# EAGLE design FAL65816_6567a (EAGLE 7.2.0)
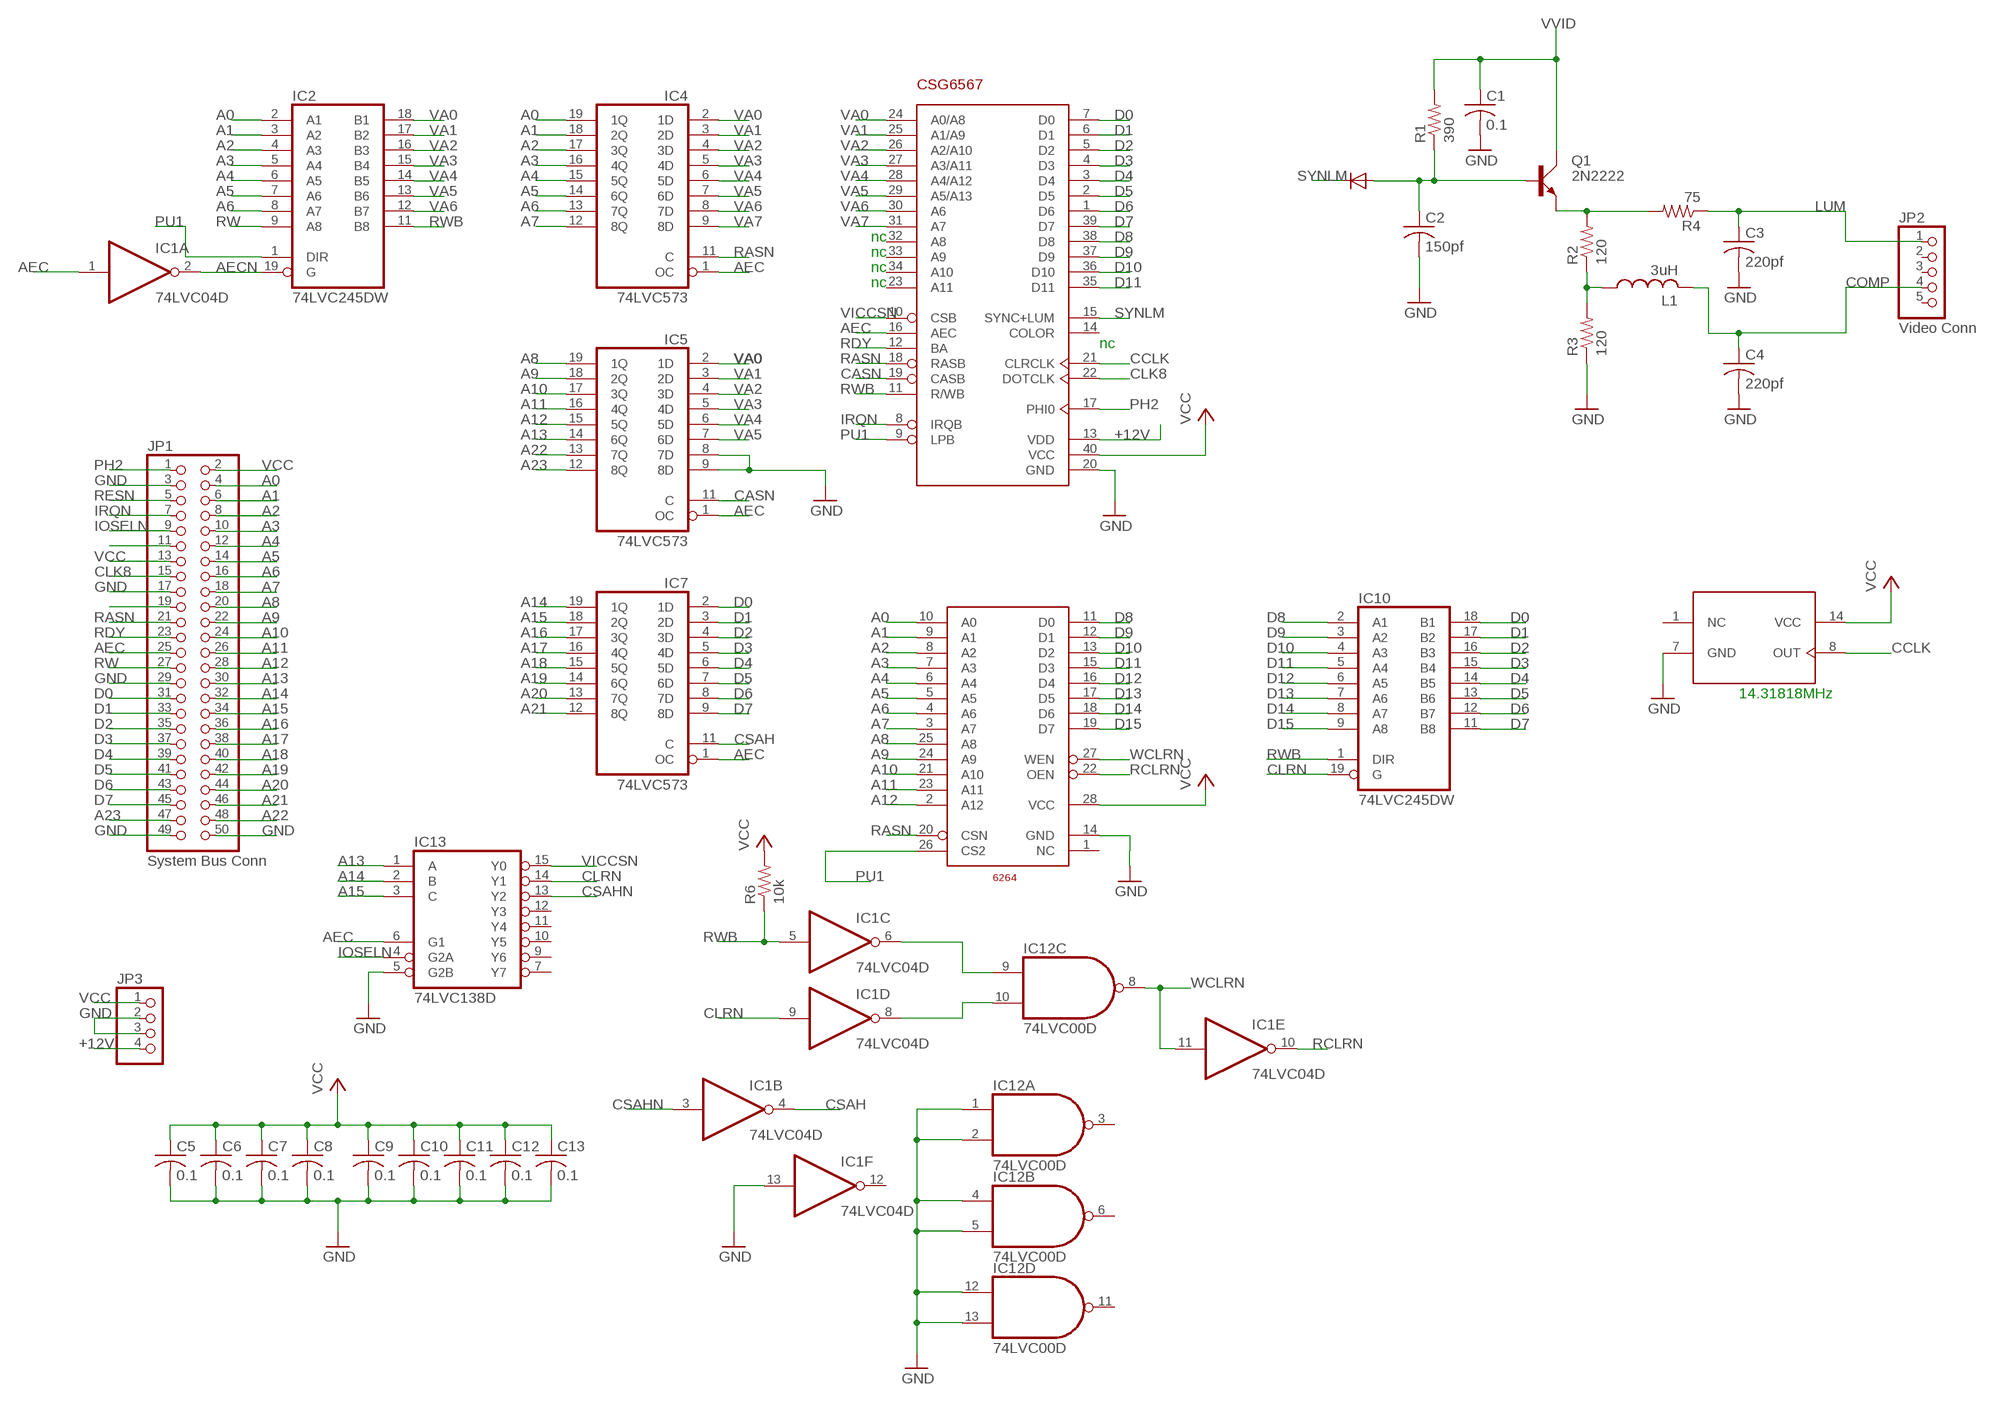
[diagram p0: schematic, sheet 1]

## Parts
C1  0.1  C-US050-024X044  [C050-024X044]
C2  150pf  C-US050-024X044  [C050-024X044]
C3  220pf  C-US050-024X044  [C050-024X044]
C4  220pf  C-US050-024X044  [C050-024X044]
C5  0.1  C-US050-024X044  [C050-024X044]
C6  0.1  C-US050-024X044  [C050-024X044]
C7  0.1  C-US050-024X044  [C050-024X044]
C8  0.1  C-US050-024X044  [C050-024X044]
C9  0.1  C-US050-024X044  [C050-024X044]
C10  0.1  C-US050-024X044  [C050-024X044]
C11  0.1  C-US050-024X044  [C050-024X044]
C12  0.1  C-US050-024X044  [C050-024X044]
C13  0.1  C-US050-024X044  [C050-024X044]
IC1  74LVC04D  74LS04D  [SO14]
IC2  74LVC245DW  74LS245DW  [SO20W]
IC4  74LVC573  [SO20W]
IC5  74LVC573  [SO20W]
IC7  74LVC573  [SO20W]
IC10  74LVC245DW  74LS245DW  [SO20W]
IC12  74LVC00D  74LS00D  [SO14]
IC13  74LVC138D  74LS138D  [SO16]
JP1  System Bus Conn  PINHD-2X25/90  [2X25/90]
JP2  Video Conn  PINHD-1X5  [1X05]
JP3  PINHD-1X4/90  [1X04/90]
L1  3uH  L-US0204/7  [0204/7]
Q1  2N2222  [TO18A]
R1  390  R-US_0204/7  [0204/7]
R2  120  R-US_0204/7  [0204/7]
R3  120  R-US_0204/7  [0204/7]
R4  75  R-US_0204/7  [0204/7]
R6  10k  R-US_0204/7  [0204/7]
U$1  CSG6567  [DIP-40]
U$3  OSC14  [DIL14]
U$4  6264  [DIL28-6]

## Nets
+12V: JP3.4 U$1.13(VDD)
A0: IC2.2(A1) IC4.19(1Q) JP1.4 U$4.10(A0)
A1: IC2.3(A2) IC4.18(2Q) JP1.6 U$4.9(A1)
A2: IC2.4(A3) IC4.17(3Q) JP1.8 U$4.8(A2)
A3: IC2.5(A4) IC4.16(4Q) JP1.10 U$4.7(A3)
A4: IC2.6(A5) IC4.15(5Q) JP1.12 U$4.6(A4)
A5: IC2.7(A6) IC4.14(6Q) JP1.14 U$4.5(A5)
A6: IC2.8(A7) IC4.13(7Q) JP1.16 U$4.4(A6)
A7: IC4.12(8Q) JP1.18 U$4.3(A7)
A8: IC5.19(1Q) JP1.20 U$4.25(A8)
A9: IC5.18(2Q) JP1.22 U$4.24(A9)
A10: IC5.17(3Q) JP1.24 U$4.21(A10)
A11: IC5.16(4Q) JP1.26 U$4.23(A11)
A12: IC5.15(5Q) JP1.28 U$4.2(A12)
A13: IC5.14(6Q) IC13.1(A) JP1.30
A14: IC7.19(1Q) IC13.2(B) JP1.32
A15: IC7.18(2Q) IC13.3(C) JP1.34
A16: IC7.17(3Q) JP1.36
A17: IC7.16(4Q) JP1.38
A18: IC7.15(5Q) JP1.40
A19: IC7.14(6Q) JP1.42
A20: IC7.13(7Q) JP1.44
A21: IC7.12(8Q) JP1.46
A22: IC5.13(7Q) JP1.48
A23: IC5.12(8Q) JP1.47
AEC: IC1.1(A:I) IC4.1(OC) IC5.1(OC) IC7.1(OC) IC13.6(G1) JP1.25 U$1.16(AEC)
AECN: IC1.2(A:O) IC2.19(G)
CASN: IC5.11(C) U$1.19(CASB)
CCLK: U$1.21(CLRCLK) U$3.8(OUT)
CLK8: JP1.15 U$1.22(DOTCLK)
CLRN: IC1.9(D:I) IC10.19(G) IC13.14(Y1)
COMP: C4.1 JP2.4 L1.2
CSAH: IC1.4(B:O) IC7.11(C)
CSAHN: IC1.3(B:I) IC13.13(Y2)
D0: IC7.2(1D) IC10.18(B1) JP1.31 U$1.7(D0)
D1: IC7.3(2D) IC10.17(B2) JP1.33 U$1.6(D1)
D2: IC7.4(3D) IC10.16(B3) JP1.35 U$1.5(D2)
D3: IC7.5(4D) IC10.15(B4) JP1.37 U$1.4(D3)
D4: IC7.6(5D) IC10.14(B5) JP1.39 U$1.3(D4)
D5: IC7.7(6D) IC10.13(B6) JP1.41 U$1.2(D5)
D6: IC7.8(7D) IC10.12(B7) JP1.43 U$1.1(D6)
D7: IC7.9(8D) IC10.11(B8) JP1.45 U$1.39(D7)
D8: IC10.2(A1) U$1.38(D8) U$4.11(D0)
D9: IC10.3(A2) U$1.37(D9) U$4.12(D1)
D10: IC10.4(A3) U$1.36(D10) U$4.13(D2)
D11: IC10.5(A4) U$1.35(D11) U$4.15(D3)
D12: IC10.6(A5) U$4.16(D4)
D13: IC10.7(A6) U$4.17(D5)
D14: IC10.8(A7) U$4.18(D6)
D15: IC10.9(A8) U$4.19(D7)
GND: C1.2 C2.2 C3.2 C4.2 C5.2 C6.2 C7.2 C8.2 C9.2 C10.2 C11.2 C12.2 C13.2 IC1.13(F:I) IC5.8(7D) IC5.9(8D) IC12.1(A:I0) IC12.2(A:I1) IC12.4(B:I0) IC12.5(B:I1) IC12.12(D:I0) IC12.13(D:I1) IC13.5(G2B) JP1.3 JP1.17 JP1.29 JP1.49 JP1.50 JP3.2 JP3.3 R3.1 U$1.20(GND) U$3.7(GND) U$4.14(GND)
IOSELN: IC13.4(G2A) JP1.9
IRQN: JP1.7 U$1.8(IRQB)
LUM: C3.1 JP2.1 R4.1
N$5: IC1.6(C:O) IC12.9(C:I0)
N$6: IC1.8(D:O) IC12.10(C:I1)
N$10: JP1.19
N$15: C2.1 Q1.B R1.1
N$17: L1.1 R2.1 R3.2
N$18: Q1.E R2.2 R4.2
N$40: JP1.11
PH2: JP1.1 U$1.17(PHI0)
PU1: IC2.1(DIR) U$1.9(LPB) U$4.26(CS2)
RASN: IC4.11(C) JP1.21 U$1.18(RASB) U$4.20(CSN)
RCLRN: IC1.10(E:O) U$4.22(OEN)
RDY: JP1.23 U$1.12(BA)
RESN: JP1.5
RW: IC2.9(A8) JP1.27
RWB: IC1.5(C:I) IC2.11(B8) IC10.1(DIR) R6.1 U$1.11(R/WB)
SYNLM: U$1.15(SYNC+LUM)
VA0: IC2.18(B1) IC4.2(1D) IC5.2(1D) U$1.24(A0/A8)
VA1: IC2.17(B2) IC4.3(2D) IC5.3(2D) U$1.25(A1/A9)
VA2: IC2.16(B3) IC4.4(3D) IC5.4(3D) U$1.26(A2/A10)
VA3: IC2.15(B4) IC4.5(4D) IC5.5(4D) U$1.27(A3/A11)
VA4: IC2.14(B5) IC4.6(5D) IC5.6(5D) U$1.28(A4/A12)
VA5: IC2.13(B6) IC4.7(6D) IC5.7(6D) U$1.29(A5/A13)
VA6: IC2.12(B7) IC4.8(7D) U$1.30(A6)
VA7: IC4.9(8D) U$1.31(A7)
VCC: C5.1 C6.1 C7.1 C8.1 C9.1 C10.1 C11.1 C12.1 C13.1 JP1.2 JP1.13 JP3.1 R6.2 U$1.40(VCC) U$3.14(VCC) U$4.28(VCC)
VICCSN: IC13.15(Y0) U$1.10(CSB)
VVID: C1.1 Q1.C R1.2
WCLRN: IC1.11(E:I) IC12.8(C:O) U$4.27(WEN)
Unconnected: IC1.12(F:O) IC12.3(A:O) IC12.6(B:O) IC12.11(D:O) IC13.7(Y7) IC13.9(Y6) IC13.10(Y5) IC13.11(Y4) IC13.12(Y3) JP2.2 JP2.3 JP2.5 U$1.14(COLOR) U$1.23(A11) U$1.32(A8) U$1.33(A9) U$1.34(A10) U$3.1(NC) U$4.1(NC)

## Notes on the sheet
- nc
- nc
- nc
- nc
- nc
- 14.31818MHz

## Power pins joined to a net without a drawn wire
GND: IC1.7(P:GND) IC2.10(GND) IC4.10(GND) IC5.10(GND) IC7.10(GND) IC10.10(GND) IC12.7(P:GND) IC13.8(GND)
VCC: IC1.14(P:VCC) IC2.20(VCC) IC4.20(VCC) IC5.20(VCC) IC7.20(VCC) IC10.20(VCC) IC12.14(P:VCC) IC13.16(VCC)

## Library data of the parts
C1 C3 C4 = resistor:C-US: CAPACITOR, American symbol
C2 C5-C13 = rcl:C-US: CAPACITOR, American symbol
IC1 = 74xx-us:74*04: Hex INVERTER
IC2 = FT74xx:74*245: Octal BUS TRANSCEIVER, 3-state
IC4 IC5 IC7 = FT74xx:74*573: 8-bit D latch BUS DRIVER
IC10 = 74xx-us:74*245: Octal BUS TRANSCEIVER, 3-state
IC12 = 74xx-us:74*00: Quad 2-input NAND gate
IC13 = FT74xx:74*138: 3-line to 8-line DECODER/DEMULTIPLEXER
JP1 = pinhead:PINHD-2X25: PIN HEADER
JP2 = pinhead:PINHD-1X5: PIN HEADER
JP3 = pinhead:PINHD-1X4: PIN HEADER
L1 = resistor:L-US: INDUCTOR, American symbol
Q1 = transistor-small-signal:2N2222: NPN TRANSISTOR
R1-R4 R6 = resistor:R-US_: RESISTOR, American symbol
U$1 = 65xxx:CSG6567
U$3 = FT74xx:OSC14
U$4 = FT74xx:6264: 8kx8 Static RAM

## Board
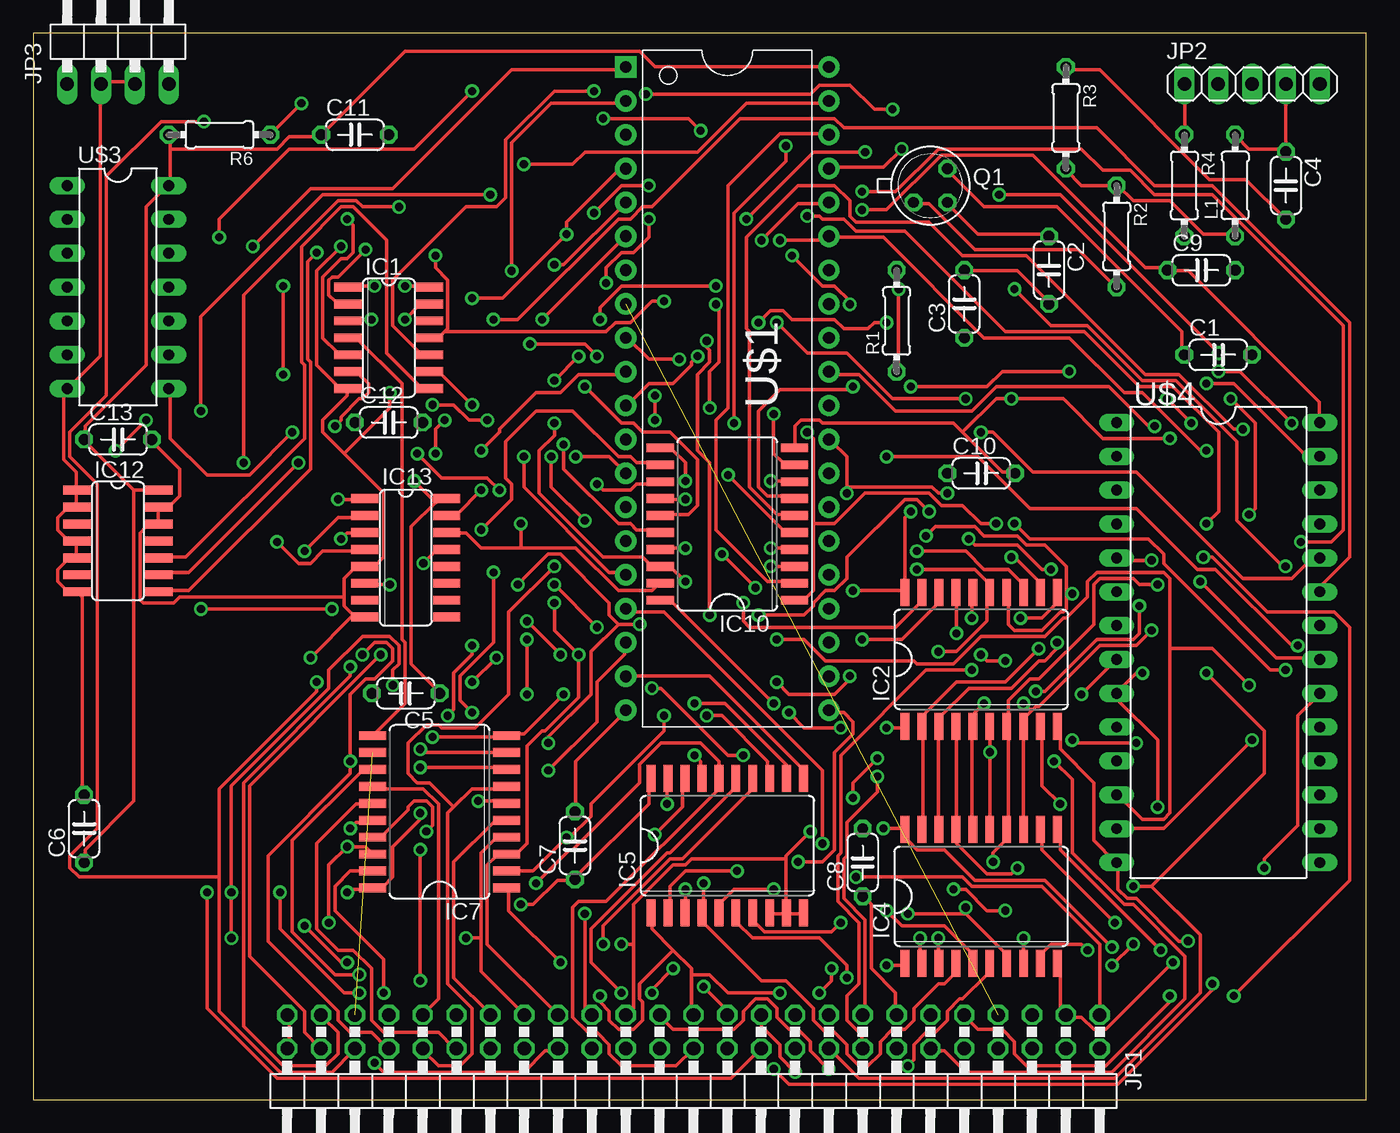
[diagram p1: board, top side]
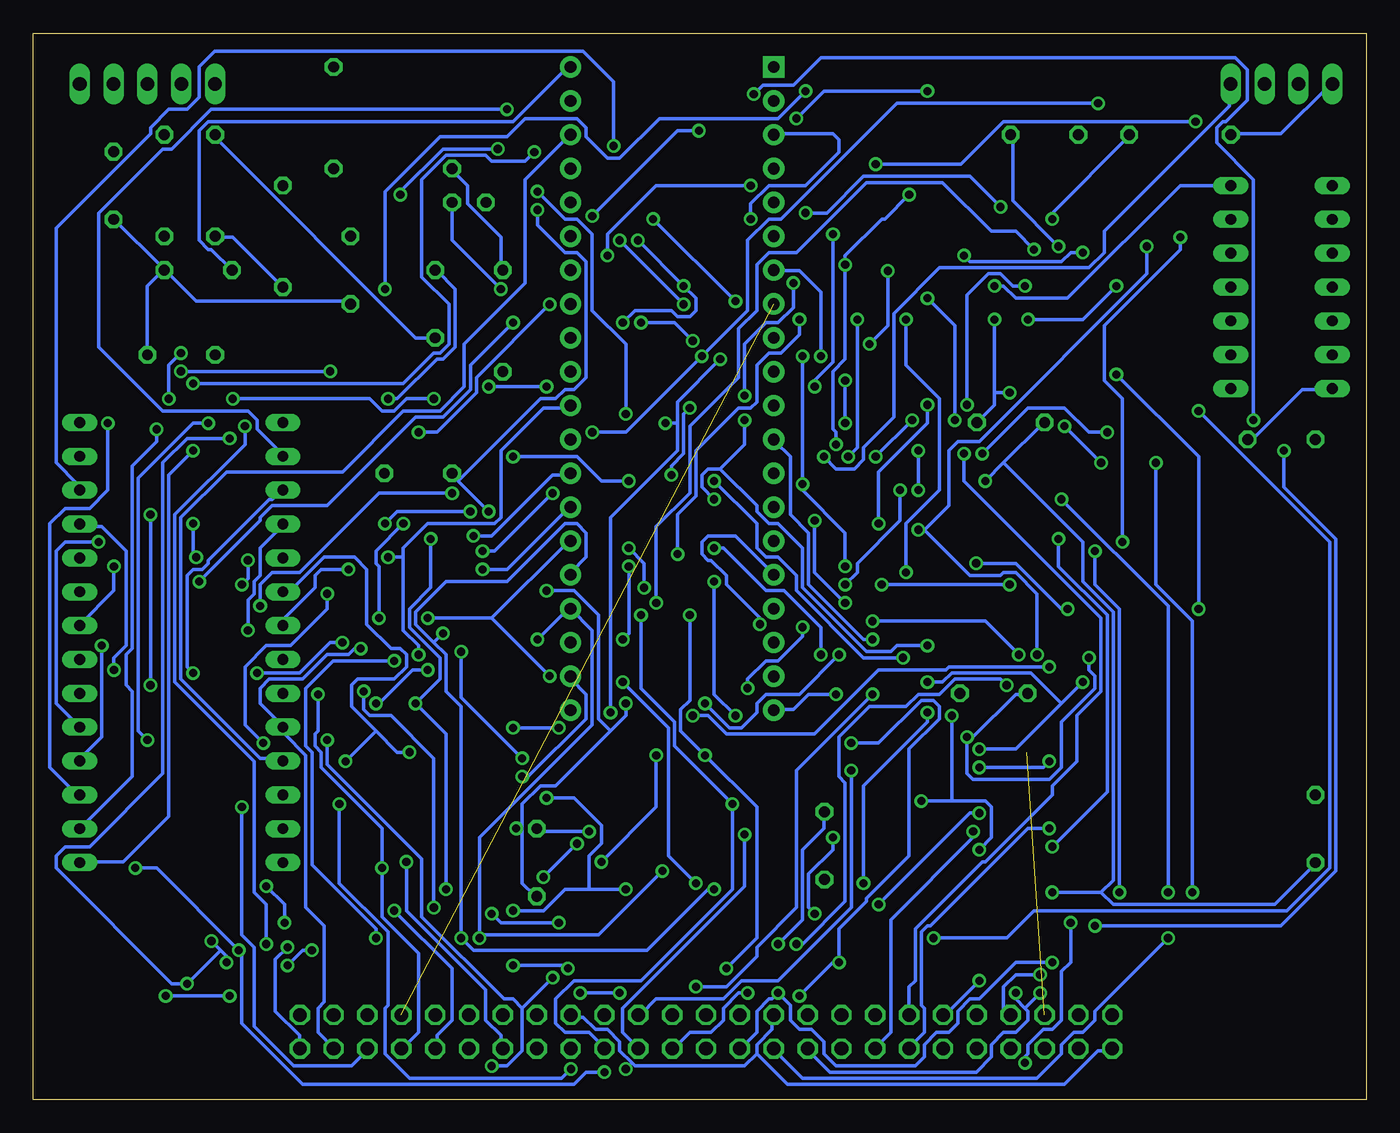
[diagram p2: board, bottom side, seen from below]

Size 100 x 80 mm. Coordinates in mm from the lower left corner, seen from the top.
Outline: 0,0 100,0 100,80 0,80 0,0
Copper layers (1*16): Top 0.035mm / dielectric 1.5mm / Bottom 0.035mm
Design rules "default": minimum track width 10mil, minimum drill 24mil, track to track 8mil, track to pad 8mil, pad to pad 8mil, via to via 8mil, smd to smd 8mil, copper to edge 40mil, drill to drill 8mil, minimum pad ring 10mil, minimum via ring 8mil, stop-mask expansion 4mil, vias tented up to drill 0mil, thermal gap 10mil

### Footprints (pad centres in the part's own frame; a part is rotated, then mirrored left to right if it is on the bottom)
C050-024X044 = drill 0.813 octagon: 1 -2.54,0; 2 2.54,0
SO14 = smd 0.66 x 2.032: 1 -3.81,-3.073; 2 -2.54,-3.073; 3 -1.27,-3.073; 4 0,-3.073; 5 1.27,-3.073; 6 2.54,-3.073; 7 3.81,-3.073; 8 3.81,3.073; 9 2.54,3.073; 10 1.27,3.073; 11 0,3.073; 12 -1.27,3.073; 13 -2.54,3.073; 14 -3.81,3.073
SO20W = smd 0.66 x 2.032: 1 -5.715,-5.029; 2 -4.445,-5.029; 3 -3.175,-5.029; 4 -1.905,-5.029; 5 -0.635,-5.029; 6 0.635,-5.029; 7 1.905,-5.029; 8 3.175,-5.029; 9 4.445,-5.029; 10 5.715,-5.029; 11 5.715,5.029; 12 4.445,5.029; 13 3.175,5.029; 14 1.905,5.029; 15 0.635,5.029; 16 -0.635,5.029; 17 -1.905,5.029; 18 -3.175,5.029; 19 -4.445,5.029; 20 -5.715,5.029
SO16 = smd 0.66 x 2.032: 1 -4.445,-3.073; 2 -3.175,-3.073; 3 -1.905,-3.073; 4 -0.635,-3.073; 5 0.635,-3.073; 6 1.905,-3.073; 7 3.175,-3.073; 8 4.445,-3.073; 9 4.445,3.073; 10 3.175,3.073; 11 1.905,3.073; 12 0.635,3.073; 13 -0.635,3.073; 14 -1.905,3.073; 15 -3.175,3.073; 16 -4.445,3.073
2X25/90 = drill 1.016 octagon: 1 -29.21,-6.35; 2 -29.21,-3.81; 3 -26.67,-6.35; 4 -26.67,-3.81; 5 -24.13,-6.35; 6 -24.13,-3.81; 7 -21.59,-6.35; 8 -21.59,-3.81; 9 -19.05,-6.35; 10 -19.05,-3.81; 11 -16.51,-6.35; 12 -16.51,-3.81; 13 -13.97,-6.35; 14 -13.97,-3.81; 15 -11.43,-6.35; 16 -11.43,-3.81; 17 -8.89,-6.35; 18 -8.89,-3.81; 19 -6.35,-6.35; 20 -6.35,-3.81; 21 -3.81,-6.35; 22 -3.81,-3.81; 23 -1.27,-6.35; 24 -1.27,-3.81; 25 1.27,-6.35; 26 1.27,-3.81; 27 3.81,-6.35; 28 3.81,-3.81; 29 6.35,-6.35; 30 6.35,-3.81; 31 8.89,-6.35; 32 8.89,-3.81; 33 11.43,-6.35; 34 11.43,-3.81; 35 13.97,-6.35; 36 13.97,-3.81; 37 16.51,-6.35; 38 16.51,-3.81; 39 19.05,-6.35; 40 19.05,-3.81; 41 21.59,-3.81; 42 21.59,-6.35; 43 24.13,-3.81; 44 24.13,-6.35; 45 26.67,-3.81; 46 26.67,-6.35; 47 29.21,-3.81; 48 29.21,-6.35; 49 31.75,-3.81; 50 31.75,-6.35
1X05 = drill 1.016 long: 1 -5.08,0; 2 -2.54,0; 3 0,0; 4 2.54,0; 5 5.08,0
1X04/90 = drill 1.016 long: 1 -3.81,-3.81; 2 -1.27,-3.81; 3 1.27,-3.81; 4 3.81,-3.81
0204/7 = drill 0.813 octagon: 1 -3.81,0; 2 3.81,0
TO18A = drill 0.813 octagon: B 1.27,-1.27; C 1.27,1.27; E -1.27,-1.27
DIP-40 = drill 0.889 pad 1.6 square: 1 -22.86,-7.62 | drill 0.889 pad 1.6: 2 -20.32,-7.62; 3 -17.78,-7.62; 4 -15.24,-7.62; 5 -12.7,-7.62; 6 -10.16,-7.62; 7 -7.62,-7.62; 8 -5.08,-7.62; 9 -2.54,-7.62; 10 0,-7.62; 11 2.54,-7.62; 12 5.08,-7.62; 13 7.62,-7.62; 14 10.16,-7.62; 15 12.7,-7.62; 16 15.24,-7.62; 17 17.78,-7.62; 18 20.32,-7.62; 19 22.86,-7.62; 20 25.4,-7.62; 21 25.4,7.62; 22 22.86,7.62; 23 20.32,7.62; 24 17.78,7.62; 25 15.24,7.62; 26 12.7,7.62; 27 10.16,7.62; 28 7.62,7.62; 29 5.08,7.62; 30 2.54,7.62; 31 0,7.62; 32 -2.54,7.62; 33 -5.08,7.62; 34 -7.62,7.62; 35 -10.16,7.62; 36 -12.7,7.62; 37 -15.24,7.62; 38 -17.78,7.62; 39 -20.32,7.62; 40 -22.86,7.62
DIL14 = drill 0.813 long: 1 -7.62,-3.81; 2 -5.08,-3.81; 3 -2.54,-3.81; 4 0,-3.81; 5 2.54,-3.81; 6 5.08,-3.81; 7 7.62,-3.81; 8 7.62,3.81; 9 5.08,3.81; 10 2.54,3.81; 11 0,3.81; 12 -2.54,3.81; 13 -5.08,3.81; 14 -7.62,3.81
DIL28-6 = drill 0.813 long: 1 -16.51,-7.62; 2 -13.97,-7.62; 3 -11.43,-7.62; 4 -8.89,-7.62; 5 -6.35,-7.62; 6 -3.81,-7.62; 7 -1.27,-7.62; 8 1.27,-7.62; 9 3.81,-7.62; 10 6.35,-7.62; 11 8.89,-7.62; 12 11.43,-7.62; 13 13.97,-7.62; 14 16.51,-7.62; 15 16.51,7.62; 16 13.97,7.62; 17 11.43,7.62; 18 8.89,7.62; 19 6.35,7.62; 20 3.81,7.62; 21 1.27,7.62; 22 -1.27,7.62; 23 -3.81,7.62; 24 -6.35,7.62; 25 -8.89,7.62; 26 -11.43,7.62; 27 -13.97,7.62; 28 -16.51,7.62

### Placement (x,y rotation side)
C1  88.9,55.88 0 top
C2  76.2,62.23 270 top
C3  69.85,59.69 90 top
C4  93.98,68.58 270 top
C5  27.94,30.48 180 top
C6  3.81,20.32 90 top
C7  40.64,19.05 90 top
C8  62.23,17.78 90 top
C9  87.63,62.23 0 top
C10  71.12,46.99 0 top
C11  24.13,72.39 0 top
C12  26.67,50.8 0 top
C13  6.35,49.53 0 top
IC1  26.67,57.15 270 top
IC2  71.12,33.02 0 top
IC4  71.12,15.24 0 top
IC5  52.07,19.05 0 top
IC7  30.48,21.59 90 top
IC10  52.07,43.18 90 top
IC12  6.35,41.91 270 top
IC13  27.94,40.64 270 top
JP1  50.8,0 180 top
JP2  91.44,76.2 0 top
JP3  6.35,80.01 0 top
L1  90.17,68.58 90 top
Q1  67.31,68.58 0 top
R1  64.77,58.42 90 top
R2  81.28,64.77 270 top
R3  77.47,73.66 270 top
R4  86.36,68.58 270 top
R6  13.97,72.39 180 top
U$1  52.07,54.61 270 top
U$3  6.35,60.96 270 top
U$4  88.9,34.29 270 top

### Tracks (layer width: path | path; a pad name or v marks a point on that pad's centre or on a via)
+12V  (via drill 0.61)
  Top 0.254: v40.69,48.23 43.2,48.23 U$1.13
  Bottom 0.254: v40.69,48.23 39.78,47.32 38.41,47.32 37.72,48.01 37.72,48.92 35.43,51.21 35.43,58.98 32,62.41 20.8,62.41 19.66,63.55 19.66,65.15 10.29,74.52 10.29,76.12 JP3.4
A0  (via drill 0.61)
  Top 0.254: IC4.19 66.75,20.34 66.75,27.89 IC2.2 66.75,28.12 66.75,28.8 69.27,31.32 72.92,31.32 v75.44,33.83
  Bottom 0.254: JP1.4 77.5,3.89 78.64,5.03 78.64,6.86 78.18,7.32 78.18,13.03 79.55,14.4 79.55,25.83 81.15,27.43 81.15,27.89 U$4.10 81.38,28.12 82.98,29.72 82.98,30.86 82.3,31.55 79.78,31.55 77.95,33.38 76.35,33.38 75.89,33.83 v75.44,33.83
A1  (via drill 0.61)
  Top 0.254: IC4.18 67.89,20.34 67.89,27.89 IC2.3 68.12,28.12 68.12,28.8 70.18,30.86 73.38,30.86 75.44,32.92 75.89,32.92 76.81,33.83 v76.81,34.29 | v84.35,21.95 84.35,26.98 81.38,29.95 81.38,30.4 U$4.9 81.38,30.63 82.75,32 v83.21,32
  Bottom 0.254: v84.35,21.95 84.35,12.34 83.44,11.43 83.44,5.49 80.47,2.52 76.12,2.52 74.98,3.66 JP1.6 | v76.81,34.29 77.72,34.29 80.01,32 v83.21,32
A2  (via drill 0.61)
  Top 0.254: IC2.4 69.27,27.89 69.27,20.34 IC4.17 69.27,20.12 69.27,19.2 71.55,16.92 73.38,16.92 v73.84,17.37 | v78.64,30.4 81.15,32.92 U$4.8
  Bottom 0.254: v78.64,30.4 78.64,27.66 78.87,27.43 78.87,26.52 78.41,26.06 78.41,24.92 73.84,20.34 v73.84,17.37 73.84,13.72 71.09,10.97 71.09,5.03 72.24,3.89 JP1.8
A3  (via drill 0.61)
  Top 0.254: IC4.16 70.41,20.34 70.41,27.89 IC2.5 70.64,28.12 70.64,29.03 v71.32,29.72 | v76.35,39.78 75.67,39.78 73.84,41.6 70.64,41.6 v70.18,42.06 | v72.92,14.17 71.55,14.17 69.95,15.77 v69.04,15.77
  Bottom 0.254: v76.35,39.78 78.41,39.78 78.87,39.32 78.87,38.41 81.15,36.12 81.15,35.66 U$4.7 | v70.18,42.06 70.18,38.41 71.78,36.8 71.78,35.43 69.49,33.15 69.49,31.55 v71.32,29.72 69.04,27.43 v69.04,15.77 | v72.92,14.17 68.58,9.83 68.58,5.94 69.72,4.8 69.72,3.89 JP1.10
A4  (via drill 0.61)
  Top 0.254: IC4.15 71.78,20.34 v71.78,26.06 71.78,27.89 IC2.6 | v76.58,25.38 77.95,24 77.95,18.52 81.84,14.63 82.53,14.63 86.41,10.74 86.41,7.54 80.92,2.06 69.95,2.06 68.35,3.66 67.44,3.66 JP1.12
  Bottom 0.254: 74.3,27.66 72.69,26.06 v71.78,26.06 | 74.3,27.66 76.12,29.49 76.12,31.09 75.67,31.55 72.92,31.55 72.01,32.46 72.01,33.38 72.47,33.83 73.15,33.83 74.98,35.66 74.98,39.78 75.89,40.69 78.18,40.69 80.7,38.18 81.15,38.18 U$4.6 | 74.3,27.66 v76.58,25.38
A5  (via drill 0.61)
  Top 0.254: v83.9,40.46 81.38,40.46 U$4.5 | v84.35,38.63 82.98,38.63 82.53,39.09 80.01,39.09 79.55,38.63 79.55,35.66 75.44,31.55 74.75,31.55 73.15,29.95 73.15,28.12 IC2.7 73.15,27.89 73.15,20.34 IC4.14 72.92,20.12 72.92,19.43 72.01,18.52 v72.01,17.83
  Bottom 0.254: v83.9,40.46 83.9,39.09 v84.35,38.63 | v72.01,17.83 72.01,14.17 66.06,8.23 66.06,5.94 64.92,4.8 64.92,3.89 JP1.14
A6  (via drill 0.61)
  Top 0.254: IC4.13 IC2.8 74.3,28.57 74.98,29.26 | v83.9,35.2 82.75,34.06 80.01,34.06 75.44,29.49 75.21,29.49 74.98,29.26 | v70.41,32.23 66.98,32.23 60.58,25.83 60.58,18.52 60.35,18.29 60.35,14.86 61.95,13.26 61.95,8.69 61.04,7.77 61.04,5.94 62.18,4.8 62.18,3.89 JP1.16 | v74.3,29.72 74.75,29.26 74.98,29.26
  Bottom 0.254: v83.9,35.2 83.9,37.49 83.44,37.95 83.44,38.86 82.98,39.32 82.98,41.38 81.38,42.98 U$4.4 | v70.41,32.23 71.55,32.23 74.07,29.72 v74.3,29.72
A7  (via drill 0.61)
  Top 0.254: v81.15,13.26 75.67,18.75 75.67,20.12 IC4.12 | 83.9,16 v82.53,16 | 83.9,16 87.55,12.34 87.55,8 81.15,1.6 61.95,1.6 59.89,3.66 JP1.18 | v88.01,32 92.35,27.66 92.35,24.46 83.9,16
  Bottom 0.254: v81.15,13.26 81.15,14.63 v82.53,16 | v88.01,32 88.47,32.46 88.47,39.32 88.01,39.78 87.33,39.78 86.87,40.23 86.87,40.46 82.3,45.03 82.07,45.03 81.38,45.72 U$4.3
A8  (via drill 0.61)
  Top 0.254: v47.55,22.17 47.55,24 IC5.19 | v93.95,32.23 92.81,32.23 84.81,40.23 84.81,40.92 83.67,42.06 74.75,42.06 v73.61,43.2 | v67.21,44.12 66.29,45.03 65.38,45.03 61.04,40.69 61.04,39.09 60.12,38.18 59.44,38.18 58.52,37.26 58.52,37.03 57.84,36.35 v54.41,36.35
  Bottom 0.254: JP1.20 57.15,3.89 58.29,5.03 60.12,5.03 60.81,5.71 60.81,7.54 59.44,8.91 54.41,8.91 47.55,15.77 v47.55,22.17 51.89,26.52 51.89,28.35 54.41,30.86 v54.41,36.35 | v93.95,32.23 93.95,33.15 93.04,34.06 93.04,41.15 94.87,42.98 96.47,42.98 U$4.25 | v73.61,43.2 72.69,44.12 v67.21,44.12
A9  (via drill 0.61)
  Top 0.254: v46.63,19.89 48.69,21.95 48.69,24 IC5.18 | v71.09,50.06 72.01,50.06 74.98,47.09 82.75,47.09 90.75,39.09 94.41,39.09 95.78,40.46 96.47,40.46 U$4.24 | v61.27,59.66 61.27,59.89 60.12,61.04 59.21,61.04 v56.92,63.32 | v46.18,68.58 44.12,68.58 v42.06,66.52 | v27.43,66.98 24.69,66.98 24.23,67.44 22.86,67.44 15.77,60.35 v15.77,47.78 | v13.03,15.54 13.03,6.86 18.29,1.6 52.35,1.6 54.41,3.66 JP1.22
  Bottom 0.254: v46.63,19.89 46.63,16 55.78,6.86 55.78,5.03 54.63,3.89 JP1.22 | v71.09,50.06 69.72,50.06 66.75,53.03 66.75,54.18 v61.27,59.66 | v56.92,63.32 56.92,64.92 53.26,68.58 v46.18,68.58 | v42.06,66.52 40.46,66.52 37.72,69.27 29.72,69.27 v27.43,66.98 | v15.77,47.78 15.77,38.63 13.03,35.89 v13.03,15.54
A10  (via drill 0.61)
  Top 0.254: v49.61,25.83 50.06,25.38 50.06,24.23 IC5.17 | v48.01,9.83 46.41,8.23 v46.41,8 | v87.55,38.86 93.27,33.15 96.47,33.15 U$4.21 | v64.01,58.29 63.09,58.29 62.64,57.84 60.81,57.84 60.12,58.52 56.92,58.52 56.24,59.21 55.32,59.21 v54.41,58.29 | v50.52,56.92 50.52,56.46 50.75,56.24 50.75,55.32 49.84,54.41 49.84,48.69 50.75,47.78 v50.75,36.35
  Bottom 0.254: v48.01,9.83 45.72,12.12 45.72,21.95 v49.61,25.83 51.44,27.66 51.44,29.26 50.75,29.95 v50.75,36.35 | v46.41,8 47.09,8 48.23,6.86 48.23,5.94 49.15,5.03 50.75,5.03 51.89,3.89 JP1.24 | v87.55,38.86 82.98,43.43 82.98,43.66 82.07,44.58 77.95,44.58 71.32,51.21 69.27,51.21 67.21,53.26 67.21,55.09 v64.01,58.29 | v54.41,58.29 51.89,58.29 v50.52,56.92
A11  (via drill 0.61)
  Top 0.254: JP1.26 48.23,2.52 44.12,2.52 43.2,3.43 43.2,4.12 42.29,5.03 41.6,5.03 40.46,6.17 40.46,14.4 40.92,14.86 42.98,14.86 51.44,23.32 IC5.16 51.44,25.38 50.06,26.75 47.09,26.75 45.49,25.15 45.49,23.77 40.46,18.75 40.23,18.75 v37.72,16.23 | v34.52,58.52 36.35,58.52 43.89,66.06 44.81,66.06 45.72,66.98 46.41,66.98 53.03,73.61 60.12,73.61 60.81,72.92 79.78,72.92 84.12,68.58 88.47,68.58 98.75,58.29 98.75,40.69 96.7,38.63 96.7,38.18 U$4.23 | v34.52,39.55 34.52,34.29 32,31.77 32,29.95 v32.92,29.03
  Bottom 0.254: v34.52,58.52 34.52,55.09 32,52.58 32,45.72 34.52,43.2 v34.52,39.55 | v32.92,29.03 32.92,28.35 37.72,23.55 v37.72,16.23
A12  (via drill 0.61)
  Top 0.254: v44.12,8 41.83,10.29 41.83,12.8 47.55,18.52 47.78,18.52 52.58,23.32 52.58,24 IC5.15 | v64.47,74.3 63.09,74.3 61.27,76.12 58.98,76.12 58.29,75.44 v45.95,75.44 | v6.17,48.69 v8.46,50.98 | v20.34,13.03 23.09,10.29 v23.55,10.29
  Bottom 0.254: JP1.28 46.86,3.89 45.72,5.03 45.72,6.63 44.81,7.54 44.58,7.54 v44.12,8 43.2,7.09 43.2,5.94 42.52,5.26 41.6,5.26 40.69,4.34 40.69,3.43 39.78,2.52 33.83,2.52 33.15,3.2 33.15,4.12 32.23,5.03 31.32,5.03 30.63,5.71 30.63,6.63 29.72,7.54 29.03,7.54 26.29,10.29 v23.55,10.29 | v64.47,74.3 86.64,74.3 89.61,71.32 90.3,71.32 95.1,66.52 95.1,56.46 90.3,51.66 83.9,51.66 83.21,50.98 83.21,50.29 81.38,48.46 U$4.2 | v45.95,75.44 45.26,76.12 42.98,76.12 40.92,78.18 9.83,78.18 8.91,77.27 8.91,74.98 10.52,73.38 10.74,73.38 11.2,72.92 11.2,71.78 8.46,69.04 v8.46,50.98 | v6.17,48.69 6.17,45.95 2.29,42.06 2.29,17.14 6.4,13.03 v20.34,13.03
A13  (via drill 0.61)
  Top 0.254: v22.86,45.03 24.69,45.03 IC13.1 | v14.86,12.12 v14.86,15.54 14.86,23.55 22.17,30.86 22.17,32.23 24.69,34.75 26.75,34.75 27.43,34.06 27.43,32.69 26.98,32.23 v26.98,31.09 | v42.75,11.66 42.75,13.03 47.78,18.06 48.69,18.06 53.95,23.32 53.95,24 IC5.14
  Bottom 0.254: v22.86,45.03 14.86,37.03 v14.86,15.54 | v14.86,12.12 20.34,6.63 20.34,5.94 21.26,5.03 21.95,5.03 22.86,4.12 22.86,3.43 24.69,1.6 42.29,1.6 44.35,3.66 JP1.30 | v42.75,11.66 42.29,11.66 39.09,14.86 39.09,23.77 39.55,24.23 39.55,27.2 37.26,29.49 34.52,29.49 33.6,30.4 32,30.4 30.86,31.55 27.43,31.55 v26.98,31.09
A14  (via drill 0.61)
  Top 0.254: IC7.19 23.77,17.14 22.63,16 22.63,14.17 26.29,10.52 v26.29,8 | v20.34,41.15 22.86,43.66 24.69,43.66 IC13.2 | v18.52,15.54 18.52,12.8 23.32,8 v24.46,8
  Bottom 0.254: v26.29,8 26.29,7.54 25.6,6.86 | 25.6,6.86 25.38,6.63 25.38,5.94 26.29,5.03 27.2,5.03 28.12,4.12 28.12,3.2 29.26,2.06 40.23,2.06 41.83,3.66 JP1.32 | v20.34,41.15 20.34,38.63 18.52,36.8 v18.52,15.54 | 25.6,6.86 v24.46,8
A15  (via drill 0.61)
  Top 0.254: v23.09,42.06 23.55,42.52 24.69,42.52 IC13.3 | IC7.18 25.38,18.52 24.92,18.97 v23.55,18.97 22.17,17.6 v22.17,13.26 | v25.6,2.74 26.29,2.06 36.8,2.06 38.41,3.66 39.32,3.66 JP1.34
  Bottom 0.254: v23.09,42.06 23.09,40.01 19.43,36.35 19.43,23.09 v23.55,18.97 | v25.6,2.74 25.6,3.2 25.38,3.43 25.38,4.12 24.23,5.26 23.55,5.26 22.86,5.94 22.86,9.6 22.17,10.29 v22.17,13.26
A16  (via drill 0.61)
  Top 0.254: v29.49,20.12 29.95,20.57 29.95,21.95 29.49,22.4 28.57,22.4 28.12,21.95 28.12,21.72 26.29,19.89 25.6,19.89 IC7.17
  Bottom 0.254: v29.49,20.12 29.49,19.66 35.66,13.49 35.66,5.03 36.8,3.89 JP1.36
A17  (via drill 0.61)
  Top 0.254: v23.77,20.34 24.23,20.8 25.38,20.8 IC7.16
  Bottom 0.254: v23.77,20.34 25.38,20.34 32.69,13.03 32.92,13.03 33.38,12.57 33.38,7.09 33.15,6.86 33.15,5.03 34.29,3.89 JP1.38
A18
  Top 0.254: IC7.15 25.38,22.17 24.23,22.17 21.26,19.2 21.26,12.8 22.86,11.2 24,11.2 25.38,9.83 25.38,5.94 26.29,5.03 30.4,5.03 31.55,3.89 JP1.40
A19
  Top 0.254: JP1.42 30.4,7.54 30.4,22.17 29.26,23.32 25.6,23.32 IC7.14
A20  (via drill 0.61)
  Top 0.254: v24.46,9.37 22.63,9.37 19.43,12.57 19.43,19.43 24.69,24.69 25.38,24.69 IC7.13
  Bottom 0.254: v24.46,9.37 26.29,9.37 27.2,8.46 27.2,6.86 26.75,6.4 JP1.44
A21  (1 unrouted)
A22  (via drill 0.61)
  Top 0.254: v50.52,28.8 51.66,28.8 55.09,25.38 55.09,24.23 IC5.13 | v23.77,32.46 23.77,31.77 15.77,23.77 15.77,5.49 18.75,2.52 21.95,2.52 22.86,3.43 22.86,5.03 21.72,6.17 JP1.48
  Bottom 0.254: v50.52,28.8 49.38,28.8 48.01,27.43 41.38,27.43 36.58,32.23 31.55,32.23 31.32,32.46 v23.77,32.46
A23  (via drill 0.61)
  Top 0.254: v49.61,29.72 51.89,29.72 56.46,25.15 56.46,24.23 IC5.12 | v37.03,35.89 v39.55,33.38 | v26.06,33.38 16.23,23.55 16.23,10.74 20.34,6.63 20.34,5.03 21.49,3.89 JP1.47
  Bottom 0.254: v49.61,29.72 47.78,27.89 46.86,27.89 45.72,29.03 45.72,29.72 45.03,30.4 42.52,30.4 v39.55,33.38 | v37.03,35.89 28.57,35.89 v26.06,33.38
AEC  (via drill 0.61)
  Top 0.254: 48.01,11.2 49.38,9.83 49.38,9.37 | 48.01,11.2 46.41,12.8 46.41,13.95 IC5.1 | 49.38,9.37 49.38,6.4 JP1.25 | v39.55,10.29 35.66,14.17 35.66,15.77 IC7.1 | v42.52,7.77 42.52,7.32 43.2,6.63 43.2,5.94 43.89,5.26 45.03,5.26 45.72,5.94 45.72,7.32 45.49,7.54 45.49,8.69 48.01,11.2 | v64.01,10.06 65.38,10.06 IC4.1 | v59.89,9.83 59.89,8.91 v58.98,8 | v56.01,8 52.12,8 50.75,9.37 49.38,9.37 | v25.6,61.04 23.77,61.04 IC1.1 | v29.95,52.12 31.55,52.12 32.69,50.98 v34.06,50.98 | v36.8,48.23 36.8,45.95 43.2,39.55 44.35,39.55 U$1.16 | v26.75,38.63 24.92,38.63 IC13.6 | v36.35,38.63 38.63,40.92 39.55,40.92 43.2,37.26 43.2,36.35 43.89,35.66 | v45.49,35.66 43.89,35.66 | v38.63,26.75 38.63,27.2 41.83,30.4 41.83,33.6 43.89,35.66
  Bottom 0.254: v42.52,7.77 40.01,10.29 v39.55,10.29 39.55,12.8 37.49,14.86 37.49,15.09 34.29,18.29 34.29,26.29 32,28.57 32,29.49 32.46,29.95 33.38,29.95 36.58,26.75 v38.63,26.75 | v64.01,10.06 60.12,10.06 v59.89,9.83 | v56.01,8 v58.98,8 | v25.6,61.04 26.52,61.04 27.43,61.95 28.35,61.95 29.95,60.35 v29.95,52.12 | v36.8,48.23 v34.06,50.98 | v36.35,38.63 v26.75,38.63 | v45.49,35.66 45.49,36.12 48.01,38.63 48.01,39.32 49.15,40.46 49.38,40.46 49.84,40.92 49.84,41.83 49.38,42.29 47.32,42.29 44.58,39.55 U$1.16
AECN  (via drill 0.61)
  Top 0.254: v53.26,37.26 53.26,35.89 53.72,35.43 64.69,35.43 66.52,37.26 66.52,37.95 IC2.19 | v24.92,63.78 22.86,61.72 22.4,61.72 22.17,61.49 22.17,60.35 22.63,59.89 23.55,59.89 IC1.2
  Bottom 0.254: v53.26,37.26 53.26,42.98 50.75,45.49 50.75,50.52 47.09,54.18 47.09,57.84 45.72,59.21 45.72,62.64 44.81,63.55 42.75,63.55 37.49,68.81 31.77,68.81 28.12,65.15 26.29,65.15 v24.92,63.78
CASN
  Top 0.254: IC5.11 57.61,24.23 57.61,24.92 50.75,31.77 44.58,31.77 U$1.19
CCLK  (via drill 0.61)
  Top 0.254: v19.43,50.06 16.23,46.86 13.03,46.86 10.29,49.61 10.29,53.26 U$3.8 | v28.8,48.46 30.63,46.63 34.06,46.63 v34.98,45.72 | v42.29,35.43 v39.09,38.63 | v46.41,30.86 47.09,30.86 52.12,25.83 v53.26,25.83 | v57.38,17.83 59.21,17.83 60.12,18.75 60.12,26.06 61.49,27.43 61.49,28.35 60.81,29.03 59.89,29.03 U$1.21
  Bottom 0.254: v19.43,50.06 20.8,50.06 22.63,51.89 25.38,51.89 v28.8,48.46 | v34.98,45.72 34.98,43.43 38.18,40.23 38.18,39.55 v39.09,38.63 | v42.29,35.43 42.29,34.75 44.12,32.92 45.03,32.92 46.41,31.55 v46.41,30.86 | v53.26,25.83 53.26,21.95 v57.38,17.83
CLK8  (via drill 0.61)
  Top 0.254: v63.32,24.23 63.32,23.09 61.04,20.8 61.04,18.29 60.81,18.06 60.81,15.09 62.41,13.49 62.41,6.4 JP1.15
  Bottom 0.254: v63.32,24.23 62.87,24.23 58.52,28.57 58.52,30.4 59.66,31.55 U$1.22
CLRN  (via drill 0.61)
  Top 0.254: 36.58,41.38 40.69,41.38 43.89,38.18 46.41,38.18 46.86,38.63 IC10.19 | 36.58,41.38 33.6,41.38 32.46,42.52 31.09,42.52 IC13.14 | v32.92,52.12 30.63,54.41 29.95,54.41 IC1.9 | 36.58,41.38 v36.58,43.2
  Bottom 0.254: v32.92,52.12 32.92,50.75 36.58,47.09 v36.58,43.2
COMP
  Top 0.254: 93.95,71.32 91.21,71.32 90.3,72.24 L1.2 | 93.95,71.32 93.95,76.12 JP2.4 | 93.95,71.32 C4.1
CSAH
  Top 0.254: IC1.4 24.23,57.15 27.66,53.72 27.66,34.52 27.89,34.29 27.89,29.72 25.6,27.43 IC7.11
CSAHN  (via drill 0.61)
  Top 0.254: v25.38,58.52 23.77,58.52 IC1.3 | v18.75,54.41 v18.75,61.04 | v22.4,36.8 v12.57,36.8 | v29.26,40.23 30.18,41.15 30.86,41.15 IC13.13
  Bottom 0.254: v25.38,58.52 21.26,58.52 v18.75,61.04 | v18.75,54.41 12.57,48.23 v12.57,36.8 | v22.4,36.8 22.86,36.8 26.29,40.23 v29.26,40.23
D0  (via drill 0.61)
  Top 0.254: IC7.2 37.49,17.14 v40.01,19.66 40.23,19.66 41.83,21.26 41.83,22.17 47.32,27.66 v47.32,28.8 | v41.38,13.95 41.38,6.86 41.83,6.4 JP1.31 | v48.92,38.86 47.78,40.01 IC10.18 46.41,40.01 45.72,40.69 42.75,40.69 37.95,45.49 37.95,48.69 39.09,49.84 v39.09,50.75 | v39.09,53.95 v40.92,55.78
  Bottom 0.254: v40.01,19.66 40.01,18.75 41.83,16.92 41.83,14.4 v41.38,13.95 | v48.92,38.86 48.92,30.4 v47.32,28.8 | v40.92,55.78 40.92,60.58 42.52,62.18 44.35,62.18 U$1.7 | v39.09,50.75 v39.09,53.95
D1  (via drill 0.61)
  Top 0.254: JP1.33 34.06,11.66 34.06,17.6 34.75,18.29 35.43,18.29 IC7.3 35.66,18.52 36.35,18.52 37.03,19.2 37.03,26.52 38.18,27.66 38.41,27.66 40.92,30.18 v40.92,33.38 39.09,35.2 v39.09,37.26 | v48.92,41.38 47.09,41.38 IC10.17 | v38.18,58.52 44.35,64.69 U$1.6 | v38.86,48.23 38.86,45.95 v41.38,43.43
  Bottom 0.254: v48.92,41.38 48.23,41.38 45.03,38.18 43.66,38.18 40.92,35.43 v40.92,33.38 | v38.18,58.52 38.18,48.92 v38.86,48.23 | v41.38,43.43 41.38,39.55 v39.09,37.26
D2  (via drill 0.61)
  Top 0.254: 33.6,12.12 33.6,9.6 36.8,6.4 JP1.35 | 33.6,12.12 33.6,18.52 34.75,19.66 35.43,19.66 IC7.4 | v39.78,49.15 39.78,47.32 43.89,43.2 44.81,43.2 45.26,42.75 46.86,42.75 IC10.16 | v39.09,62.64 39.78,62.64 U$1.5 | v32.46,12.12 33.6,12.12 | v12.57,51.66 12.57,58.75 21.72,67.89 v34.29,67.89
  Bottom 0.254: v39.78,49.15 39.78,50.06 40.01,50.29 40.01,54.63 39.09,55.55 v39.09,62.64 39.09,63.32 36.35,66.06 36.12,66.06 v34.29,67.89 | v32.46,12.12 26.98,12.12 24.92,14.17 5.94,14.17 2.74,17.37 2.74,41.83 v12.57,51.66
D3  (via drill 0.61)
  Top 0.254: IC7.5 35.43,20.8 34.52,20.8 31.55,17.83 31.55,9.14 34.29,6.4 JP1.37 | v41.38,53.49 44.12,50.75 45.03,50.75 45.72,50.06 47.78,50.06 49.84,48.01 49.84,44.58 49.15,43.89 47.09,43.89 IC10.15 | U$1.4 44.35,69.72 43.89,69.72 40.01,65.84 v40.01,64.92 35.2,60.12 v32.92,60.12 | v30.18,48.46 30.18,50.29 v30.86,50.98
  Bottom 0.254: v41.38,53.49 41.38,53.95 40.01,55.32 v40.01,64.92 | JP1.37 34.29,8.46 33.83,8.91 33.83,12.8 28.8,17.83 28.57,17.83 23.55,22.86 23.55,23.55 21.72,25.38 21.72,28.8 19.89,30.63 19.89,36.12 30.18,46.41 v30.18,48.46 | v30.86,50.98 30.86,58.06 v32.92,60.12
D4  (via drill 0.61)
  Top 0.254: v33.38,22.4 35.43,22.4 IC7.6 | v29.03,8.91 v29.03,18.75 | v48.92,45.03 47.09,45.03 IC10.14 | v32.92,34.06 32.92,33.38 31.55,32 31.55,29.26 v31.09,28.8 | v46.18,66.06 46.18,64.69 45.03,63.55 44.12,63.55 42.98,62.41 v42.98,61.27 | v46.63,50.98 v46.63,52.81
  Bottom 0.254: 31.09,22.4 28.57,22.4 28.12,21.95 28.12,19.66 v29.03,18.75 | 31.09,22.4 v33.38,22.4 | v29.03,8.91 31.55,6.4 JP1.39 | v48.92,45.03 49.84,45.95 49.84,46.86 49.38,47.32 48.46,47.32 | 48.46,47.32 45.72,44.58 45.72,44.12 44.81,43.2 44.12,43.2 42.29,41.38 42.29,38.41 37.49,33.6 35.66,33.6 35.2,34.06 v32.92,34.06 | 31.09,22.4 v31.09,28.8 | v46.18,66.06 46.18,67.21 44.81,68.58 42.06,68.58 39.55,71.09 39.55,72.01 40.01,72.47 44.35,72.47 U$1.3 | v42.98,61.27 42.98,59.44 44.12,58.29 45.03,58.29 46.63,56.69 v46.63,52.81 | v46.63,50.98 46.63,49.15 48.46,47.32
D5  (via drill 0.61)
  Top 0.254: 31.55,21.95 31.09,21.49 31.09,8.69 32.92,6.86 32.92,3.43 32,2.52 30.4,2.52 29.26,3.66 JP1.41 | 31.55,21.95 32.92,23.32 35.43,23.32 IC7.7 | v42.29,46.18 42.75,45.72 44.81,45.72 45.26,46.18 46.86,46.18 IC10.13 | v39.09,40.01 35.66,36.58 35.66,30.4 33.15,27.89 30.63,27.89 30.4,28.12 29.49,28.12 28.12,26.75 28.12,24.46 28.8,23.77 29.72,23.77 31.55,21.95 | v35.89,62.18 35.89,71.78 38.86,74.75 44.35,74.75 U$1.2 | v37.26,56.69 41.38,56.69 v42.29,55.78
  Bottom 0.254: v39.09,40.01 39.09,42.52 42.29,45.72 v42.29,46.18 v42.29,55.78 | v35.89,62.18 35.89,58.06 v37.26,56.69
D6  (via drill 0.61)
  Top 0.254: v29.03,24.92 35.43,24.92 IC7.8 | JP1.43 26.52,3.89 25.38,5.03 23.77,5.03 22.86,5.94 22.86,6.63 17.6,11.89 17.6,18.29 23.77,24.46 v23.77,25.38 23.77,30.4 24.92,31.55 25.6,31.55 26.98,32.92 26.98,33.83 26.52,34.29 25.6,34.29 v24.69,33.38 | v33.6,42.75 35.89,45.03 35.89,46.18 35.43,46.63 35.43,49.38 37.72,51.66 40.46,51.66 43.89,48.23 44.81,48.23 45.26,47.78 46.86,47.78 IC10.12 | v16.46,64.01 20.8,68.35 26.98,68.35 35.89,77.27 44.35,77.27 U$1.1
  Bottom 0.254: v29.03,24.92 24.23,24.92 v23.77,25.38 | 33.15,42.75 29.72,39.32 27.43,39.32 27.2,39.55 26.29,39.55 24.69,37.95 v24.69,33.38 | v16.46,64.01 16.46,61.95 29.03,49.38 30.63,49.38 31.32,48.69 31.32,44.58 33.15,42.75 | 33.15,42.75 v33.6,42.75
D7  (via drill 0.61)
  Top 0.254: v29.03,26.29 29.26,26.06 35.43,26.06 IC7.9 | v21.26,31.32 21.26,30.63 13.95,23.32 13.95,16.69 | 13.95,16.69 13.95,6.63 18.52,2.06 22.4,2.06 24,3.66 JP1.45 | v48.92,46.41 48.92,47.78 48.01,48.69 47.09,48.69 IC10.11 | v32.92,31.32 v34.75,33.15 | v36.8,70.18 40.46,70.18 41.38,71.09 49.84,71.09 53.49,74.75 59.66,74.75 U$1.39 | v12.8,73.38 9.6,73.38 5.49,69.27 5.49,52.81 2.74,50.06 2.74,48.23 4.8,46.18 4.8,20.34 2.74,18.29 2.74,17.37 3.43,16.69 13.95,16.69
  Bottom 0.254: v29.03,26.29 26.29,26.29 22.86,29.72 | v21.26,31.32 22.86,29.72 | v48.92,46.41 45.72,43.2 45.72,41.38 45.03,40.69 44.12,40.69 42.75,39.32 42.75,38.18 37.72,33.15 v34.75,33.15 | v32.92,31.32 31.77,31.32 31.09,32 25.15,32 22.86,29.72 | v36.8,70.18 30.4,70.18 27.2,73.38 v12.8,73.38
D8
  Top 0.254: IC10.2 56.92,38.86 55.09,38.86 51.21,42.75 51.21,50.98 52.12,51.89 52.12,68.58 56.01,72.47 59.66,72.47 U$1.38
  Bottom 0.254: U$4.11 81.38,25.6 82.98,25.6 88.92,31.55 88.92,43.66 85.5,47.09 76.81,47.09 72.24,51.66 69.49,51.66 67.67,53.49 67.67,56.69 63.09,61.27 63.09,69.04 59.89,72.24 U$1.38
D9  (via drill 0.61)
  Top 0.254: v55.32,40.01 IC10.3 | v55.78,34.52 57.84,34.52 59.44,32.92 66.06,32.92 66.29,32.69 69.04,32.69 71.09,34.75 75.89,34.75 77.27,36.12 77.5,36.12 79.1,37.72 79.1,38.86 79.78,39.55 84.81,39.55 85.27,39.09 85.27,33.83 | 85.27,33.83 85.27,21.49 84.81,21.03 83.21,21.03 81.38,22.86 U$4.12 | v65.15,71.32 63.78,69.95 59.89,69.95 U$1.37 | v72.47,67.89 77.04,67.89 v88.92,56.01 | v89.84,52.58 91.67,50.75 91.67,44.35 v91.21,43.89 | v91.21,31.09 88.47,33.83 85.27,33.83
  Bottom 0.254: v55.32,40.01 55.32,34.98 v55.78,34.52 | v65.15,71.32 69.27,71.32 72.47,68.12 v72.47,67.89 | v88.92,56.01 89.84,55.09 v89.84,52.58 | v91.21,31.09 v91.21,43.89
D10  (via drill 0.61)
  Top 0.254: v55.32,41.38 56.92,41.38 IC10.4 | v51.66,40.92 v54.18,38.41 | v42.52,58.52 42.52,59.44 44.12,61.04 v51.21,61.04 | v54.63,64.47 57.38,67.21 59.66,67.21 U$1.36 | v91.44,26.98 84.81,20.34 81.38,20.34 U$4.13 | v85.04,52.58 v86.87,50.75 | v69.95,52.58 64.47,52.58 61.04,56.01 58.06,56.01 v55.78,58.29
  Bottom 0.254: v55.32,41.38 54.18,40.23 v54.18,38.41 | v51.66,40.92 51.66,43.89 50.29,45.26 50.29,48.69 47.09,51.89 46.18,51.89 45.72,52.35 45.72,55.09 44.81,56.01 43.89,56.01 42.52,57.38 v42.52,58.52 | v54.63,64.47 v51.21,61.04 50.29,60.12 50.29,59.21 50.75,58.75 51.66,58.75 52.12,59.21 54.86,59.21 v55.78,58.29 | v91.44,26.98 92.13,27.66 92.13,46.63 88.01,50.75 v86.87,50.75 | v85.04,52.58 74.75,52.58 73.84,51.66 72.92,51.66 72.01,52.58 v69.95,52.58
D11  (via drill 0.61)
  Top 0.254: v52.12,46.86 56.24,42.75 56.92,42.75 IC10.5 | v50.75,51.89 50.75,54.63 51.44,55.32 51.44,59.44 v51.21,59.66 | v56.01,64.47 59.44,64.47 59.66,64.69 U$1.35 59.89,64.69 63.78,64.69 71.32,57.15 77.72,57.15 81.84,53.03 83.21,53.03 87.55,48.69 v88.01,48.69
  Bottom 0.254: v52.12,46.86 52.12,47.55 51.21,48.46 51.21,51.44 v50.75,51.89 | v56.01,64.47 v51.21,59.66 | v88.01,48.69 89.84,46.86 89.84,21.26 93.27,17.83 96.47,17.83 U$4.15
D12  (via drill 0.61)
  Top 0.254: v90.75,50.29 90.07,50.29 85.95,54.41 83.44,54.41 74.52,63.32 69.72,63.32 67.21,65.84 61.72,65.84 61.27,66.29 61.27,67.44 60.12,68.58 57.38,68.58 53.49,64.69 53.49,57.84 53.72,57.61 53.72,45.95 55.78,43.89 56.92,43.89 IC10.6
  Bottom 0.254: v90.75,50.29 90.75,49.38 92.58,47.55 92.58,33.83 93.04,33.38 93.04,31.09 92.58,30.63 92.58,24.23 96.47,20.34 U$4.16
D13  (via drill 0.61)
  Top 0.254: v61.49,53.49 61.27,53.26 56.01,53.26 54.41,51.66 54.41,45.95 55.09,45.26 56.92,45.26 IC10.7 | v65.84,53.49 71.55,53.49 72.69,54.63 v77.72,54.63 | v88.92,54.63 90.53,54.63 v94.41,50.75
  Bottom 0.254: v65.84,53.49 v61.49,53.49 | v88.92,54.63 v77.72,54.63 | v94.41,50.75 94.41,45.72 95.78,44.35 97.61,44.35 98.75,43.2 98.75,24.92 96.7,22.86 U$4.17
D14  (via drill 0.61)
  Top 0.254: v55.32,46.41 56.92,46.41 IC10.8 | v64.01,48.23 70.87,48.23 74.75,44.35 82.75,44.35 87.33,39.78 88.7,39.78 94.41,34.06 v94.87,34.06
  Bottom 0.254: v55.32,46.41 57.38,46.41 59.21,48.23 v64.01,48.23 | v94.87,34.06 94.87,27.2 96.47,25.6 U$4.18
D15  (via drill 0.61)
  Top 0.254: v55.55,51.44 55.55,48.46 56.24,47.78 56.92,47.78 IC10.9 | v62.18,68.12 64.69,68.12 67.89,71.32 78.64,71.32 80.24,69.72 82.3,69.72 84.12,67.89 88.47,67.89 98.3,58.06 98.3,42.75 97.38,41.83 v95.1,41.83
  Bottom 0.254: v55.55,51.44 55.55,56.69 58.06,59.21 58.06,64.92 59.21,66.06 60.12,66.06 v62.18,68.12 | v95.1,41.83 97.61,41.83 98.3,41.15 98.3,29.72 U$4.19
GND  (via drill 0.61)
  Top 0.254: v27.89,58.52 29.03,59.66 29.72,59.66 IC1.13 | 24,36.35 24.69,36.35 IC13.8 24,36.35 | 24,36.35 23.32,37.03 23.32,37.72 | 23.32,37.72 23.32,39.09 24.23,40.01 IC13.5 25.6,40.01 26.29,40.69 26.29,45.49 23.32,48.46 | 23.32,48.46 21.72,50.06 21.72,50.98 23.55,52.81 23.55,53.26 IC1.7 23.55,53.49 22.86,53.49 21.26,55.09 21.26,62.18 v23.09,64.01 | v26.75,53.03 26.75,51.89 23.32,48.46 | 3.2,45.72 3.2,44.58 IC12.2 3.2,44.35 2.52,44.35 1.83,43.66 1.83,42.75 2.52,42.06 3.2,42.06 IC12.4 3.2,41.83 3.2,40.69 IC12.5 3.2,40.46 2.52,40.46 1.83,39.78 1.83,38.86 2.52,38.18 3.2,38.18 IC12.7 3.66,37.72 3.66,22.86 C6.2 | JP3.3 7.54,76.35 5.26,76.35 JP3.2 5.03,76.12 5.03,55.78 2.74,53.49 U$3.7 2.52,53.26 2.29,53.03 2.29,48.01 3.2,47.09 3.2,45.72 | C13.2 8.91,49.38 10.97,47.32 10.97,45.26 10.29,44.58 9.6,44.58 IC12.13 9.37,44.35 9.37,43.2 IC12.12 9.37,42.98 8.46,42.98 8,42.52 8,37.49 8.23,37.26 10.52,37.26 10.97,37.72 23.32,37.72 | 3.2,45.72 IC12.1 | 69.72,50.06 72.69,47.09 73.61,47.09 C10.2 | 69.72,50.06 69.04,50.75 59.21,50.75 58.98,50.98 57.61,50.98 57.15,50.52 57.15,48.92 IC10.10 | C3.2 69.95,62.18 73.84,62.18 76.12,59.89 C2.2 | C4.2 90.98,69.04 88.24,69.04 80.01,77.27 77.5,77.27 R3.1 | 69.72,50.06 72.24,52.58 v73.38,52.58 77.27,52.58 80.24,49.61 v85.27,49.61 | IC4.10 77.04,10.06 77.04,6.63 77.27,6.4 JP1.3 77.5,6.17 78.64,6.17 79.55,5.26 80.47,5.26 v85.5,10.29 | IC2.10 77.04,27.89 77.04,26.29 79.55,23.77 79.55,19.43 81.15,17.83 U$4.14 81.38,17.6 81.38,15.77 82.07,15.09 82.75,15.09 85.95,11.89 v86.64,11.89 | v39.78,30.4 36.8,27.43 35.66,27.43 IC7.10 35.43,27.2 v29.95,27.2
  Top 0.254: C7.2 40.69,21.72 40.69,25.38 44.35,29.03 U$1.20 | IC5.8 55.32,13.95 56.46,13.95 IC5.9 | IC5.10 57.61,13.95 56.69,13.95 IC5.9 | v58.29,20.12 56.46,18.29 56.46,18.06 | 56.46,18.06 56.46,14.17 IC5.9 | JP1.49 19.2,3.89 19.2,6.17 JP1.50 | 56.46,18.06 49.38,18.06 48.92,17.6 48.01,17.6 45.03,14.63 45.03,11.66 | 45.03,11.66 45.03,6.86 44.58,6.4 JP1.29 | 45.03,11.66 v44.12,11.66 | v88.47,8.69 88.47,8.23 81.38,1.14 56.69,1.14 v55.55,2.29 | v20.8,33.15 24,36.35
  Bottom 0.254: 27.89,53.03 27.89,52.12 C12.2 | 27.89,53.03 v27.89,58.52 | v23.09,64.01 26.52,67.44 26.52,72.24 C11.2 | v26.75,53.03 27.89,53.03 | U$3.7 2.74,53.26 4.8,53.26 8.69,49.38 C13.2 | C9.2 90.3,62.41 93.95,66.06 C4.2 | C1.2 91.44,61.04 90.3,62.18 C9.2 | C2.2 76.35,59.89 87.78,59.89 90.07,62.18 C9.2 | v73.38,52.58 72.69,52.58 69.72,55.55 69.27,55.55 68.35,56.46 68.35,60.81 69.72,62.18 C3.2 | v85.5,10.29 85.5,10.74 85.95,11.2 | v86.64,11.89 85.95,11.2 | v39.78,30.4 41.83,30.4 42.98,29.26 44.35,29.26 U$1.20 | C5.2 25.6,30.4 26.29,30.4 29.49,27.2 v29.95,27.2 29.95,24.46 29.49,24 23.77,24 22.86,24.92 22.86,28.35 20.34,30.86 20.34,31.77 20.8,32.23 v20.8,33.15 | v58.29,20.12 62.18,20.12 C8.2 | 45.72,3.43 45.72,4.12 44.58,5.26 44.58,6.17 JP1.29 | 45.72,3.43 46.63,2.52 54.86,2.52 55.09,2.74 | 55.09,2.74 56.01,3.66 56.01,4.34 56.92,5.26 57.84,5.26 58.75,6.17 59.66,6.17 JP1.17 | 45.72,3.43 43.43,1.14 22.63,1.14 20.12,3.66 19.2,3.66 JP1.49 | v44.12,11.66 42.29,13.49 42.29,18.75 40.69,20.34 40.69,21.49 C7.2 | 85.95,11.2 v88.47,8.69 89.61,8.69 98.3,17.37 98.3,18.29 97.61,18.97 95.78,18.97 90.3,24.46 90.3,47.78 88.47,49.61 v85.27,49.61 | 55.09,2.74 v55.55,2.29
IOSELN  (via drill 0.61)
  Top 0.254: v18.29,41.83 19.89,40.23 20.8,40.23 21.72,41.15 24.69,41.15 IC13.4 | v13.95,64.69 13.95,66.06 19.2,71.32 28.57,71.32 v32.92,75.67 | v42.75,73.61 49.15,73.61 v50.06,72.69 | v58.06,66.29 58.98,66.29 59.21,66.06 60.81,66.06 61.72,65.15 65.38,65.15 72.92,57.61 78.87,57.61 82.98,53.49 85.5,53.49 88.92,50.06 88.92,44.12 v88.01,43.2 | v87.78,40.69 88.47,40.69 92.58,36.58 97.61,36.58 98.75,35.43 98.75,16.46 v90.07,7.77 | v85.27,7.77 85.27,7.32 80.47,2.52 74.52,2.52 73.61,3.43 73.61,4.34 72.69,5.26 70.87,5.26 69.95,6.17 JP1.9
  Bottom 0.254: v18.29,41.83 18.29,52.58 19.66,53.95 19.66,58.06 13.95,63.78 v13.95,64.69 | v32.92,75.67 40.69,75.67 v42.75,73.61 | v50.06,72.69 51.66,72.69 v58.06,66.29 | v88.01,43.2 88.01,40.92 v87.78,40.69 | v85.27,7.77 v90.07,7.77
IRQN  (1 unrouted)
LUM
  Top 0.254: JP2.1 86.41,76.12 86.41,72.47 R4.1
  Bottom 0.254: C3.1 71.32,57.15 86.41,72.24 R4.1
N$5  (via drill 0.61)
  Top 0.254: v19.89,47.78 11.66,39.55 9.6,39.55 IC12.9 | v22.63,50.52 23.09,50.98 23.09,51.21 24.46,52.58 24.69,52.58 25.15,53.03 25.15,53.72 24.46,54.41 23.77,54.41 IC1.6
  Bottom 0.254: v22.63,50.52 v19.89,47.78
N$6
  Top 0.254: IC12.10 9.6,40.69 11.43,40.69 20.34,49.61 20.34,55.09 20.12,55.32 20.12,64.01 23.09,66.98 24,66.98 26.52,64.47 26.52,56.01 29.03,53.49 29.72,53.49 IC1.8
N$15  (via drill 0.61)
  Top 0.254: v64.92,60.81 64.92,54.63 R1.1 | C2.1 76.12,64.92 70.87,64.92 68.58,67.21 Q1.B
  Bottom 0.254: v64.92,60.81 68.58,64.47 Q1.B
N$17
  Top 0.254: R3.2 77.5,69.72 78.64,68.58 R2.1 81.38,68.58 82.53,67.44 85.27,67.44 87.78,64.92 90.07,64.92 L1.1
N$18
  Top 0.254: Q1.E 66.06,67.21 67.21,67.21 70.64,63.78 78.41,63.78 81.15,61.04 R2.2
  Bottom 0.254: R4.2 86.18,64.69 85.04,64.69 81.38,61.04 R2.2
PH2  (via drill 0.61)
  Top 0.254: JP1.1 80.01,11.66 75.67,16 70.41,16 69.72,16.69 v61.72,16.69 | v59.21,19.2 59.21,24.69 47.32,36.58 44.81,36.58 44.58,36.8 U$1.17
  Bottom 0.254: v59.21,19.2 v61.72,16.69
PU1  (via drill 0.61)
  Top 0.254: v64.01,27.89 65.38,27.89 IC2.1 | v60.58,27.89 57.84,27.89 v56.69,29.03 | v48.46,55.55 46.18,55.55 44.58,57.15 U$1.9 | v56.46,71.55 56.46,70.41 52.58,66.52 v52.58,50.75
  Bottom 0.254: v60.58,27.89 v64.01,27.89 | v56.69,29.03 56.69,43.66 51.66,48.69 51.66,50.75 | 51.66,50.75 51.66,52.35 v48.46,55.55 | v56.46,71.55 56.46,76.35 58.75,78.64 86.41,78.64 87.55,77.5 87.55,75.21 88.47,74.3 89.84,74.3 91.21,72.92 91.21,72.47 98.3,65.38 98.3,47.78 96.7,46.18 96.7,45.72 U$4.26 | 51.66,50.75 v52.58,50.75
RASN  (via drill 0.61)
  Top 0.254: v84.58,11.2 77.04,18.75 77.04,20.12 IC4.11 | v92.35,17.37 92.35,18.06 94.87,20.57 94.87,28.8 96.47,30.4 U$4.20 | v57.15,2.06 56.01,3.2 56.01,4.12 54.63,5.49 54.63,6.17 JP1.21 | v38.63,24.69 42.29,28.35 42.29,31.32 44.35,33.38 44.35,34.29 U$1.18
  Bottom 0.254: v92.35,17.37 90.75,17.37 v84.58,11.2 84.35,10.97 84.35,5.71 79.78,1.14 59.44,1.14 58.52,2.06 v57.15,2.06 | v38.63,24.69 38.63,14.4 44.12,8.91 46.86,8.91 48.23,7.54 53.26,7.54 54.41,6.4 JP1.21
RCLRN  (via drill 0.61)
  Top 0.254: v42.06,75.67 39.09,75.67 35.43,72.01 35.43,67.67 34.75,66.98 32.46,66.98 26.98,61.49 26.98,58.06 29.03,56.01 29.72,56.01 IC1.10 | v73.61,60.81 76.35,58.06 79.1,58.06 83.21,53.95 85.72,53.95 90.3,49.38 90.3,43.43 93.73,40.01 v93.95,40.01
  Bottom 0.254: v42.06,75.67 44.12,73.61 53.03,73.61 56.01,70.64 56.92,70.64 58.52,72.24 58.52,72.92 59.21,73.61 63.09,73.61 64.47,72.24 69.49,72.24 73.61,68.12 v73.61,60.81 | v93.95,40.01 93.95,38.18 96.47,35.66 U$4.22
RDY  (via drill 0.61)
  Top 0.254: v50.29,8.46 51.89,6.86 51.89,6.4 JP1.23 | v37.03,34.52 v37.03,30.4
  Bottom 0.254: v50.29,8.46 48.01,8.46 45.72,10.74 45.72,11.43 42.75,14.4 42.75,24.69 v37.03,30.4 | v37.03,34.52 37.72,34.52 41.83,38.63 41.83,42.52 43.2,43.89 43.2,48.23 44.35,49.38 U$1.12
RW  (via drill 0.61)
  Top 0.254: v77.04,22.17 75.67,23.55 75.67,27.89 IC2.9 | v59.66,2.29 58.29,3.66 58.29,4.34 57.38,5.26 56.69,5.26 55.78,6.17 55.78,6.86 55.09,7.54 54.18,7.54 53.26,6.63 53.26,5.94 52.58,5.26 48.01,5.26 47.09,6.17 JP1.27
  Bottom 0.254: v77.04,22.17 77.04,16.23 73.38,12.57 73.38,7.09 73.61,6.86 73.61,3.43 71.78,1.6 60.35,1.6 v59.66,2.29
RWB  (via drill 0.61)
  Top 0.254: v23.55,66.06 24,65.61 24,63.55 23.55,63.09 23.09,63.09 21.72,61.72 21.72,57.15 22.86,56.01 23.55,56.01 IC1.5 | 58.52,43.2 58.52,49.61 v58.06,50.06 | 58.52,43.2 58.52,38.18 57.84,37.49 57.15,37.49 IC10.1 | v49.84,55.78 49.38,55.32 49.38,55.09 48.01,53.72 46.18,53.72 44.58,52.12 U$1.11 | v74.07,36.12 75.67,36.12 76.81,37.26 76.81,37.95 IC2.11 | v72.24,43.2 71.09,43.2 69.72,44.58 68.12,44.58 67.21,45.49 62.41,45.49 60.12,43.2 58.52,43.2 | v20.12,74.75 17.83,72.47 R6.1
  Bottom 0.254: v23.55,66.06 23.55,66.52 17.83,72.24 R6.1 | v58.06,50.06 55.55,50.06 v49.84,55.78 46.41,59.21 46.41,64.47 44.81,66.06 43.89,66.06 35.2,74.75 v20.12,74.75 | v74.07,36.12 74.07,40.01 74.3,40.23 74.3,41.15 v72.24,43.2
VA0  (via drill 0.61)
  Top 0.254: v66.52,12.12 66.52,10.29 IC4.2 | v52.81,17.14 48.92,17.14 47.78,16 47.78,14.17 IC5.2 | v62.18,34.52 65.15,34.52 67.89,37.26 67.89,37.95 IC2.18
  Bottom 0.254: 66.52,12.34 66.52,19.66 58.06,28.12 58.06,35.2 U$1.24 59.89,36.8 v62.18,34.52 | v52.81,17.14 57.61,12.34 66.52,12.34 | 66.52,12.34 v66.52,12.12
VA1  (via drill 0.61)
  Top 0.254: v67.89,12.12 67.89,10.29 IC4.3 | v48.92,15.77 48.92,14.17 IC5.3 | v69.27,34.98 69.27,37.95 IC2.17
  Bottom 0.254: 69.95,34.29 71.32,35.66 71.32,36.58 69.04,38.86 64.47,38.86 60.12,43.2 59.21,43.2 58.52,42.52 58.52,40.69 59.66,39.55 U$1.25 | 69.95,34.29 69.04,33.38 69.04,30.63 67.89,29.49 v67.89,12.12 66.98,11.2 53.95,11.2 49.38,15.77 v48.92,15.77 | 69.95,34.29 v69.27,34.98
VA2  (via drill 0.61)
  Top 0.254: v70.41,36.12 70.41,37.95 IC2.16 | IC4.4 69.04,10.06 69.04,9.37 68.35,8.69 67.89,8.69 66.06,6.86 66.06,5.94 65.38,5.26 64.47,5.26 63.55,4.34 63.55,3.43 62.64,2.52 61.95,2.52 61.04,3.43 61.04,4.12 60.12,5.03 59.44,5.03 58.52,5.94 58.52,6.86 56.46,8.91 54.63,8.91 50.29,13.26 50.29,13.95 IC5.4 50.29,14.17 v50.29,16.23 | v61.27,31.77 61.27,31.55 60.12,30.4 56.69,30.4 v55.78,31.32
  Bottom 0.254: 65.61,36.12 v70.41,36.12 | 65.61,36.12 59.89,41.83 U$1.26 | v61.27,31.77 65.61,36.12 | v55.78,31.32 52.35,27.89 52.35,18.29 v50.29,16.23
VA3  (via drill 0.61)
  Top 0.254: v66.29,39.78 70.64,39.78 71.55,38.86 71.55,38.18 IC2.15 71.55,37.95 71.55,35.89 69.27,33.6 v67.89,33.6 | IC5.5 51.44,14.63 52.58,15.77 v55.55,15.77 | v64.01,14.17 65.15,13.03 68.35,13.03 70.41,10.97 70.41,10.29 IC4.5 | v63.32,25.6 61.49,23.77 v61.49,22.63
  Bottom 0.254: v66.29,39.78 64.47,39.78 59.89,44.35 U$1.27 | 58.29,15.77 60.12,15.77 61.72,14.17 v64.01,14.17 | 58.29,15.77 v55.55,15.77 | v67.89,33.6 67.89,30.18 v63.32,25.6 | v61.49,22.63 59.44,22.63 57.38,20.57 57.38,19.2 58.29,18.29 58.29,15.77
VA4  (via drill 0.61)
  Top 0.254: 77.5,37.95 77.5,40.01 75.89,41.6 74.52,41.6 73.84,42.29 71.32,42.29 70.64,42.98 67.67,42.98 v66.98,42.29 | 77.5,37.95 77.5,36.8 77.27,36.58 77.04,36.58 75.67,35.2 73.61,35.2 73.15,35.66 73.15,37.95 IC2.14 | v65.61,2.52 66.06,2.97 66.06,4.12 66.98,5.03 67.67,5.03 68.58,5.94 68.58,6.63 69.49,7.54 69.72,7.54 71.55,9.37 71.55,10.06 IC4.6 | v61.04,9.14 61.04,10.06 58.98,12.12 53.95,12.12 52.81,13.26 52.81,13.95 IC5.6 | v77.95,37.95 77.5,37.95 | v82.75,26.75 78.18,26.75 v77.95,26.98
  Bottom 0.254: v66.98,42.29 65.61,42.29 61.04,46.86 59.89,46.86 U$1.28 | v65.61,2.52 64.47,2.52 63.32,3.66 63.32,6.86 | v61.04,9.14 63.32,6.86 | v77.95,37.95 77.95,36.8 80.7,34.06 82.53,34.06 84.12,32.46 84.12,28.12 v82.75,26.75 | v77.95,26.98 77.95,25.15 70.87,18.06 70.87,13.72 64.69,7.54 64.01,7.54 63.32,6.86
VA5  (via drill 0.61)
  Top 0.254: v60.58,13.26 59.89,12.57 54.86,12.57 54.18,13.26 54.18,13.95 IC5.7 | 69.95,13.95 v65.61,13.95 | 69.95,13.95 72.92,10.97 72.92,10.29 IC4.7 | IC2.13 74.3,38.63 73.15,39.78 71.32,39.78 69.95,41.15 v66.29,41.15 | 61.04,45.95 61.04,48.23 59.89,49.38 U$1.29 | v69.95,14.4 69.95,13.95 | v75.21,30.63 75.89,30.63 79.78,34.52 82.53,34.52 82.98,34.98 v82.98,37.03 | v68.58,45.49 67.89,45.49 67.44,45.95 61.04,45.95 | 61.04,45.95 v61.04,45.49
  Bottom 0.254: v60.58,13.26 64.92,13.26 v65.61,13.95 | v66.29,41.15 65.38,41.15 v61.04,45.49 | v69.95,14.4 69.95,25.6 73.15,28.8 74.75,28.8 75.21,29.26 v75.21,30.63 | v82.98,37.03 82.98,38.63 82.07,39.55 80.01,39.55 74.07,45.49 v68.58,45.49
VA6  (via drill 0.61)
  Top 0.254: v74.3,12.12 IC4.8 | v72.92,32.92 71.55,32.92 v71.09,33.38 | v73.38,40.69 73.61,40.69 75.44,38.86 75.44,38.18 IC2.12
  Bottom 0.254: v74.3,12.12 74.3,12.8 79.1,17.6 79.1,26.06 79.55,26.52 79.55,30.86 77.5,32.92 v72.92,32.92 | v71.09,33.38 71.09,34.06 72.24,35.2 72.24,40.69 | 72.24,40.69 72.24,41.38 70.41,43.2 65.38,43.2 64.92,43.66 64.92,48.69 61.72,51.89 59.89,51.89 U$1.30 | 72.24,40.69 v73.38,40.69
VA7  (via drill 0.61)
  Top 0.254: v79.1,11.2 78.64,11.66 76.35,11.66 75.67,10.97 75.67,10.29 IC4.9 | v82.53,11.66 v80.92,10.06 | v84.12,50.52 83.67,50.52 80.7,53.49 72.24,53.49 70.41,51.66 64.69,51.66 61.95,54.41 59.89,54.41 U$1.31
  Bottom 0.254: v79.1,11.2 79.78,11.2 v80.92,10.06 | v82.53,11.66 82.53,14.63 83.44,15.54 83.44,25.38 89.38,31.32 89.38,43.89 84.12,49.15 v84.12,50.52
VCC  (via drill 0.61)
  Top 0.254: 30.18,44.81 28.35,42.98 28.35,32.69 30.4,30.63 C5.1 | 30.18,44.81 30.4,45.03 30.86,45.03 IC13.16 30.18,44.81 | 30.18,44.81 v28.57,46.41 | IC5.20 46.18,24 46.18,22.17 40.69,16.69 C7.1 40.46,16.46 39.32,16.46 37.49,14.63 v36.58,14.63 | v23.55,15.54 23.77,15.77 25.38,15.77 IC7.20 25.6,16 26.29,16 26.98,16.69 26.98,18.97 29.03,21.03 v29.03,21.49 | 65.38,38.18 65.38,43.66 v65.84,44.12 | v55.55,29.72 48.01,37.26 47.09,37.26 IC10.20 | v63.78,20.34 65.38,20.34 IC4.20 65.61,20.12 65.61,19.43 66.29,18.75 68.35,18.75 70.64,16.46 75.89,16.46 v80.92,11.43 | JP1.13 64.69,6.4 64.69,8 62.87,9.83 62.87,14.63 62.41,15.09 C8.1 | v61.49,38.18 65.38,38.18 | 65.38,38.18 IC2.20 | U$4.28 96.47,50.98 96.47,52.35 86.64,62.18 85.27,62.18 C9.1 85.04,62.41 83.44,62.41 74.98,70.87 68.12,70.87 64.01,66.75 v62.18,66.75 | 7.54,45.72 IC12.14 | 7.54,45.72 3.89,49.38 C13.1 3.89,49.61 3.89,50.52 8.46,55.09 8.46,66.98 10.06,68.58 U$3.14 10.29,68.58 10.29,71.32 | v27.89,61.04 29.72,61.04 IC1.14 | 10.29,71.32 10.29,72.24 R6.2 | 10.29,71.32 18.29,71.32 19.2,72.24 21.49,72.24 C11.1 21.72,72.47 27.89,78.64 45.49,78.64 46.63,77.5 59.66,77.5 U$1.40 | 7.54,45.72 7.54,22.4 3.89,18.75 3.89,17.83 C6.1
  Bottom 0.254: v28.57,46.41 27.2,47.78 | 27.2,47.78 24.23,50.75 C12.1 | 19.89,15.54 v23.55,15.54 | 19.89,15.54 18.97,14.63 6.86,14.63 3.89,17.6 C6.1 | v36.58,14.63 29.72,21.49 v29.03,21.49 | 27.2,47.78 21.26,41.83 21.26,38.86 18.97,36.58 18.97,16.46 19.89,15.54 | 68.12,46.41 68.58,46.86 C10.1 | 68.12,46.41 v65.84,44.12 | v55.55,29.72 55.55,28.8 56.69,27.66 | 56.69,27.66 60.81,23.55 61.95,23.55 63.32,22.17 63.32,20.34 | 63.32,20.34 63.32,16.23 62.41,15.32 C8.1 | 63.32,20.34 v63.78,20.34 | JP1.2 80.01,4.8 81.84,6.63 81.84,10.52 v80.92,11.43 | v61.49,38.18 59.44,38.18 57.61,36.35 57.61,28.57 56.69,27.66 | v27.89,61.04 27.2,61.04 26.29,60.12 22.4,60.12 13.95,68.58 U$3.14 | JP3.1 2.74,76.12 6.4,72.47 10.06,72.47 R6.2 | C9.1 86.64,63.78 86.87,63.78 87.55,64.47 87.55,72.69 86.87,73.38 64.01,73.38 59.89,77.5 U$1.40 | 68.12,46.41 61.95,52.58 60.81,52.58 60.12,53.26 59.44,53.26 58.52,54.18 58.52,62.87 59.21,63.55 60.12,63.55 62.18,65.61 v62.18,66.75
VICCSN  (via drill 0.61)
  Top 0.254: v33.6,45.72 31.77,43.89 31.09,43.89 IC13.15 | v33.6,48.69 34.98,50.06 34.98,50.29 37.72,53.03 39.55,53.03 40.92,54.41 44.35,54.41 U$1.10
  Bottom 0.254: v33.6,48.69 v33.6,45.72
VVID
  Top 0.254: C1.1 86.18,56.01 86.18,57.61 76.81,66.98 71.32,66.98 68.58,69.72 Q1.C
  Bottom 0.254: R1.2 64.92,62.41 64.92,64.69 67.44,67.21 67.44,68.58 68.58,69.72 Q1.C
WCLRN  (via drill 0.61)
  Top 0.254: v21.26,63.55 20.57,62.87 20.57,55.55 20.8,55.32 20.8,47.32 11.66,38.18 9.6,38.18 IC12.8 | v30.18,63.32 30.18,62.41 31.09,61.49 31.09,57.84 30.86,57.61 | 30.86,57.61 30.4,57.15 IC1.11 | v88.01,53.72 90.07,53.72 95.33,48.46 96.47,48.46 U$4.27 | v62.41,71.09 58.52,71.09 v53.49,66.06 | v47.32,59.89 46.41,59.89 44.81,58.29 43.66,58.29 42.98,57.61 30.86,57.61
  Bottom 0.254: v21.26,63.55 22.17,63.55 22.86,62.87 29.72,62.87 v30.18,63.32 | v88.01,53.72 72.24,53.72 69.95,56.01 69.49,56.01 68.81,56.69 68.81,59.66 70.87,61.72 70.87,69.04 69.04,70.87 66.06,70.87 65.61,70.41 63.09,70.41 v62.41,71.09 | v47.32,59.89 v53.49,66.06